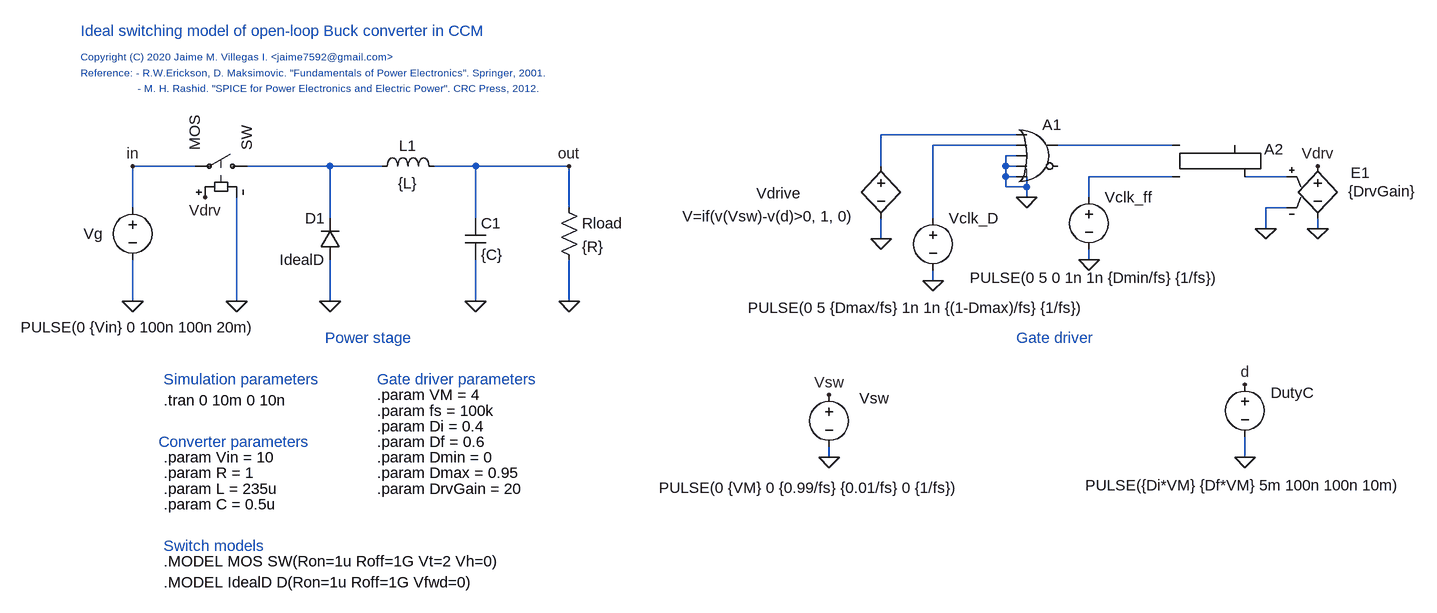
[diagram p0: schematic Buck_Ideal_OL_CCM_sw.asc]
Buck_Ideal_OL_CCM_sw.asc, the LTspice schematic file:
Version 4
SHEET 1 4224 2016
WIRE 1024 320 816 320
WIRE 1024 336 896 336
WIRE 1264 336 1088 336
WIRE 1024 352 1008 352
WIRE -240 368 -336 368
WIRE -32 368 -160 368
WIRE 48 368 -32 368
WIRE 192 368 128 368
WIRE 336 368 192 368
WIRE 816 368 816 320
WIRE 1008 368 1008 352
WIRE 1024 368 1008 368
WIRE 1008 384 1008 368
WIRE 1024 384 1008 384
WIRE 1264 384 1136 384
WIRE 1440 384 1376 384
WIRE 1008 400 1008 384
WIRE 1040 400 1040 384
WIRE 1040 400 1008 400
WIRE 1040 416 1040 400
WIRE 1136 416 1136 384
WIRE -336 432 -336 368
WIRE 336 432 336 368
WIRE 1440 432 1408 432
WIRE -32 448 -32 368
WIRE 192 448 192 368
WIRE 896 448 896 336
WIRE 1408 464 1408 432
WIRE 1488 464 1488 448
WIRE 816 480 816 448
WIRE 1136 512 1136 496
WIRE 896 544 896 528
WIRE -336 576 -336 512
WIRE -176 576 -176 416
WIRE -32 576 -32 512
WIRE 192 576 192 512
WIRE 336 576 336 512
WIRE 736 816 736 800
WIRE 1376 816 1376 784
FLAG 192 576 0
FLAG 336 576 0
FLAG -336 576 0
FLAG -336 368 in
FLAG 336 368 out
FLAG -32 576 0
FLAG 736 816 0
FLAG 1376 816 0
FLAG 1376 704 d
FLAG 736 720 Vsw
FLAG 816 480 0
FLAG 1040 416 0
FLAG 896 544 0
FLAG 1136 512 0
FLAG 1488 464 0
FLAG 1408 464 0
FLAG -224 416 Vdrv
FLAG 1488 368 Vdrv
FLAG -176 576 0
SYMBOL ind 32 384 R270
WINDOW 0 32 56 VTop 2
WINDOW 3 5 56 VBottom 2
SYMATTR InstName L1
SYMATTR Value {L}
SYMBOL cap 176 448 R0
SYMATTR InstName C1
SYMATTR Value {C}
SYMBOL res 320 416 R0
SYMATTR InstName Rload
SYMATTR Value {R}
SYMBOL voltage -336 416 R0
WINDOW 0 -75 56 Left 2
WINDOW 3 -172 200 Left 2
WINDOW 123 0 0 Left 0
WINDOW 39 0 0 Left 0
SYMATTR InstName Vg
SYMATTR Value PULSE(0 {Vin} 0 100n 100n 20m)
SYMBOL voltage 736 704 R0
WINDOW 0 47 21 Left 2
WINDOW 3 -262 159 Left 2
WINDOW 123 0 0 Left 0
WINDOW 39 0 0 Left 0
SYMATTR InstName Vsw
SYMATTR Value PULSE(0 {VM} 0 {0.99/fs} {0.01/fs} 0 {1/fs})
SYMBOL sw -144 368 M270
SYMATTR InstName SW
SYMATTR Value MOS
SYMBOL diode -16 512 R180
WINDOW 0 24 64 Left 2
WINDOW 3 24 0 Left 2
SYMATTR InstName D1
SYMATTR Value IdealD
SYMBOL voltage 1376 688 R0
WINDOW 3 -246 171 Left 2
WINDOW 123 0 0 Left 0
WINDOW 39 0 0 Left 0
WINDOW 0 40 29 Left 2
SYMATTR Value PULSE({Di*VM} {Df*VM} 5m 100n 100n 10m)
SYMATTR InstName DutyC
SYMBOL bv 816 352 R0
WINDOW 3 -306 93 Left 2
WINDOW 0 -192 58 Left 2
SYMATTR Value V=if(v(Vsw)-v(d)>0, 1, 0)
SYMATTR InstName Vdrive
SYMBOL e 1488 352 R0
WINDOW 0 51 26 Left 2
WINDOW 3 47 55 Left 2
SYMATTR InstName E1
SYMATTR Value {DrvGain}
SYMBOL Digital\\or 1056 288 R0
SYMATTR InstName A1
SYMBOL voltage 896 432 R0
WINDOW 3 -285 154 Left 2
SYMATTR Value PULSE(0 5 {Dmax/fs} 1n 1n {(1-Dmax)/fs} {1/fs})
SYMATTR InstName Vclk_D
SYMBOL voltage 1136 400 R0
WINDOW 3 -183 140 Left 2
SYMATTR Value PULSE(0 5 0 1n 1n {Dmin/fs} {1/fs})
SYMATTR InstName Vclk_ff
SYMBOL Digital\\srflop 1312 288 R0
SYMATTR InstName A2
TEXT -288 816 Left 2 !.param Vin = 10
TEXT -288 864 Left 2 !.param L = 235u
TEXT -288 728 Left 2 !.tran 0 10m 0 10n
TEXT -288 888 Left 2 !.param C = 0.5u
TEXT -288 840 Left 2 !.param R = 1
TEXT -296 792 Left 2 ;Converter parameters
TEXT -288 696 Left 2 ;Simulation parameters
TEXT -416 160 Left 2 ;Ideal switching model of open-loop Buck converter in CCM
TEXT -416 224 Left 1 ;Reference: - R.W.Erickson, D. Maksimovic. "Fundamentals of Power Electronics". Springer, 2001.
TEXT -416 200 Left 1 ;Copyright (C) 2020 Jaime M. Villegas I. <jaime7592@gmail.com>
TEXT -288 1008 Left 2 !.MODEL IdealD D(Ron=1u Roff=1G Vfwd=0)
TEXT -288 976 Left 2 !.MODEL MOS SW(Ron=1u Roff=1G Vt=2 Vh=0)
TEXT 40 720 Left 2 !.param VM = 4
TEXT 40 744 Left 2 !.param fs = 100k
TEXT -288 952 Left 2 ;Switch models
TEXT 40 768 Left 2 !.param Di = 0.4
TEXT 40 792 Left 2 !.param Df = 0.6
TEXT -328 248 Left 1 ;- M. H. Rashid. "SPICE for Power Electronics and Electric Power". CRC Press, 2012.
TEXT 40 864 Left 2 !.param DrvGain = 20
TEXT 40 696 Left 2 ;Gate driver parameters
TEXT 40 840 Left 2 !.param Dmax = 0.95
TEXT 40 816 Left 2 !.param Dmin = 0
TEXT -40 632 Left 2 ;Power stage
TEXT 1024 632 Left 2 ;Gate driver

The netlist it stands for:
* Buck_Ideal_OL_CCM_sw.asc
L1 N004 out {L}
C1 out 0 {C}
Rload out 0 {R}
Vg in 0 PULSE(0 {Vin} 0 100n 100n 20m)
Vsw Vsw 0 PULSE(0 {VM} 0 {0.99/fs} {0.01/fs} 0 {1/fs})
SW N004 in Vdrv 0 MOS
D1 0 N004 IdealD
V§DutyC d 0 PULSE({Di*VM} {Df*VM} 5m 100n 100n 10m)
B§Vdrive N001 0 V=if(v(Vsw)-v(d)>0, 1, 0)
E1 Vdrv 0 N006 0 {DrvGain}
A1 N001 N002 0 0 0 0 N003 0 OR
Vclk_D N002 0 PULSE(0 5 {Dmax/fs} 1n 1n {(1-Dmax)/fs} {1/fs})
Vclk_ff N005 0 PULSE(0 5 0 1n 1n {Dmin/fs} {1/fs})
A2 N003 N005 0 0 0 N006 0 0 SRFLOP
.model D D
.lib standard.dio
.param Vin = 10
.param L = 235u
.tran 0 10m 0 10n
.param C = 0.5u
.param R = 1
* Converter parameters
* Simulation parameters
* Ideal switching model of open-loop Buck converter in CCM
* Reference: - R.W.Erickson, D. Maksimovic. "Fundamentals of Power Electronics". Springer, 2001.
* Copyright (C) 2020 Jaime M. Villegas I. <jaime7592@gmail.com>
.MODEL IdealD D(Ron=1u Roff=1G Vfwd=0)
.MODEL MOS SW(Ron=1u Roff=1G Vt=2 Vh=0)
.param VM = 4
.param fs = 100k
* Switch models
.param Di = 0.4
.param Df = 0.6
* - M. H. Rashid. "SPICE for Power Electronics and Electric Power". CRC Press, 2012.
.param DrvGain = 20
* Gate driver parameters
.param Dmax = 0.95
.param Dmin = 0
* Power stage
* Gate driver
.backanno
.end